# Altium project Outdoor_Tracking.PrjPcb (part 2 of 2)

## Sheet Antennas.SchDoc
size A3; ApprovedBy: Mustafa Atılay Beycan; CheckedBy: Mustafa Atılay Beycan; Author: Mustafa Atılay Beycan; CompanyName: Mustafa Atılay Beycan; DrawnBy: Mustafa Atılay Beycan; Engineer: Mustafa Atılay Beycan; Organization: Mustafa Atılay Beycan; SheetNumber: 6; SheetTotal: 8; FilePath: https://github.com/mustafaatilay/Outdoor-Tracking-Project
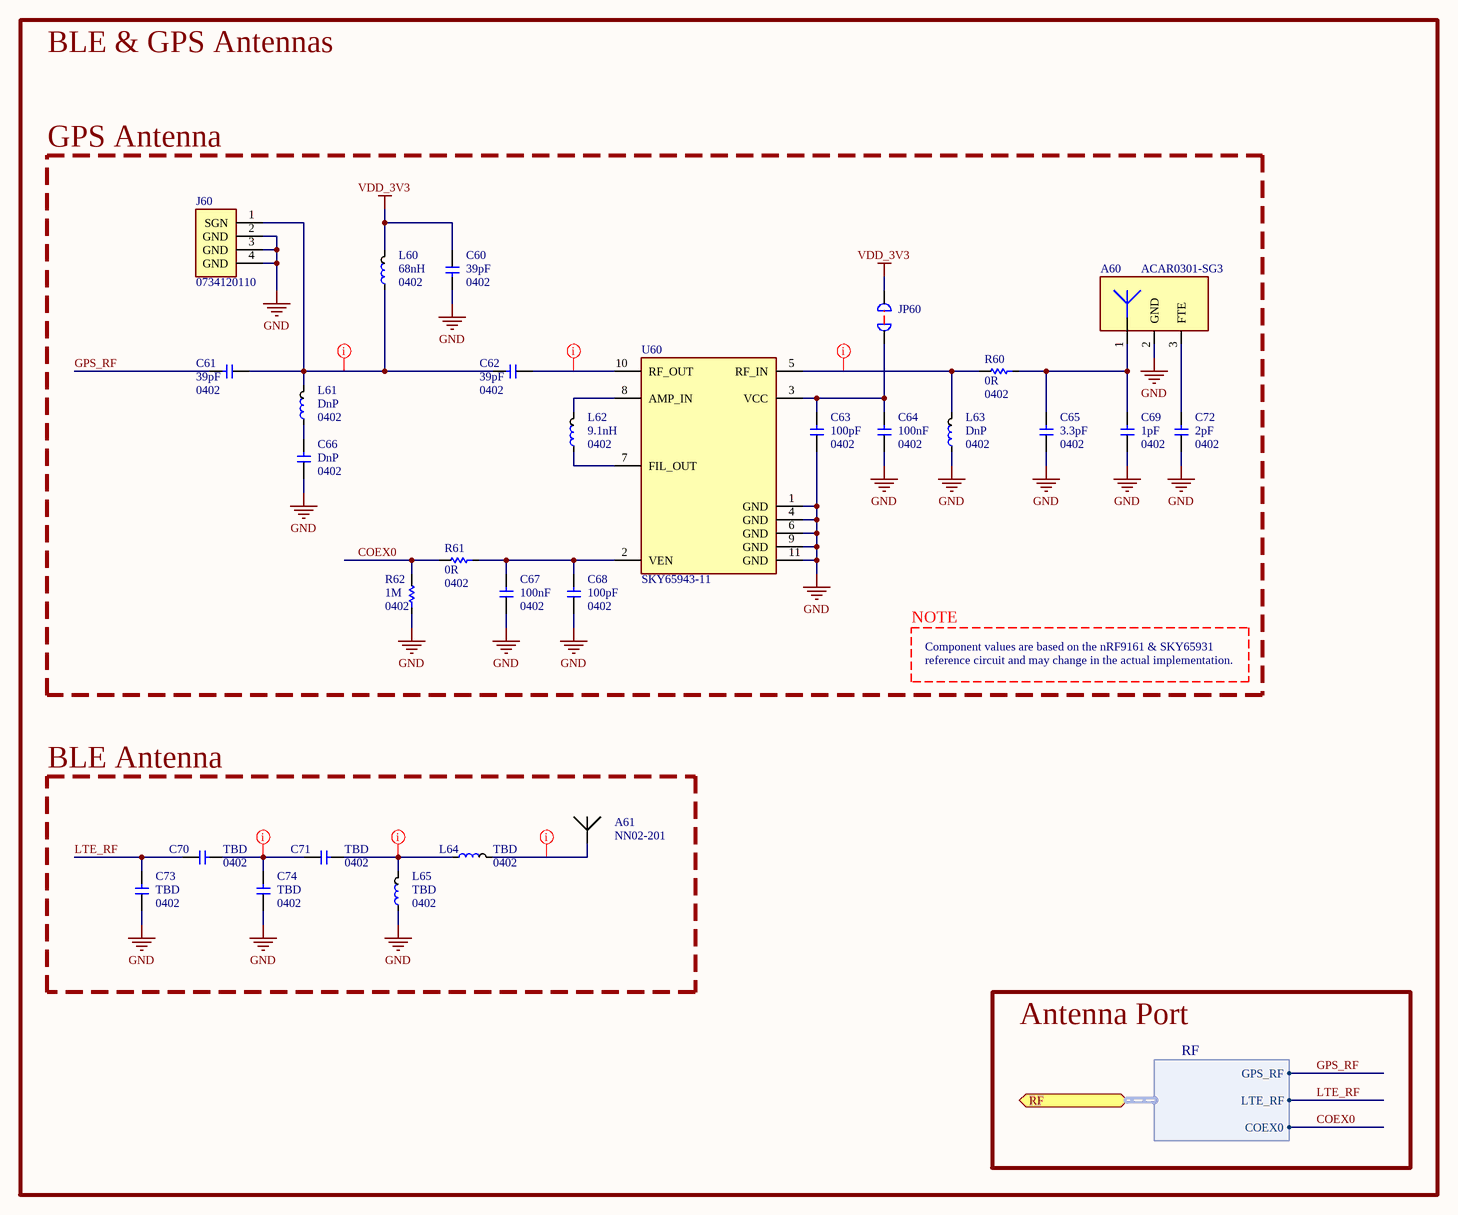
[diagram p6: Antennas.SchDoc]

### Parts
A60  ACAR0301-SG3  [ANT GPS ACAR0301-SG3]
A61  NN02-201  [ANT NN02-201]
C60  Capacitance: 39pF  Package: 0402  [CAP 0402]  (hidden comment: 39pF 1% NP0 25V 0402 SMD)
C61  Capacitance: 39pF  Package: 0402  [CAP 0402]  (hidden comment: 39pF 1% NP0 25V 0402 SMD)
C62  Capacitance: 39pF  Package: 0402  [CAP 0402]  (hidden comment: 39pF 1% NP0 25V 0402 SMD)
C63  Capacitance: 100pF  Package: 0402  [CAP 0402]  (hidden comment: 100pF 10% X7R 50V 0402 SMD)
C64  Capacitance: 100nF  Package: 0402  [CAP 0402]  (hidden comment: 100nF 10% X7R 50V 0402 SMD)
C65  Capacitance: 3.3pF  Package: 0402  [CAP 0402]  (hidden comment: 3.3pF * * * 0402 SMD)
C66  Capacitance: DnP  Package: 0402  [CAP 0402]  (hidden comment: DnP * * * 0402 SMD)
C67  Capacitance: 100nF  Package: 0402  [CAP 0402]  (hidden comment: 100nF 10% X7R 50V 0402 SMD)
C68  Capacitance: 100pF  Package: 0402  [CAP 0402]  (hidden comment: 100pF 10% X7R 50V 0402 SMD)
C69  Capacitance: 1pF  Package: 0402  [CAP 0402]  (hidden comment: 1pF * * * 0402 SMD)
C70  Capacitance: TBD  Package: 0402  [CAP 0402]  (hidden comment: TBD TBD TBD * 0402 SMD)
C71  Capacitance: TBD  Package: 0402  [CAP 0402]  (hidden comment: TBD TBD TBD * 0402 SMD)
C72  Capacitance: 2pF  Package: 0402  [CAP 0402]  (hidden comment: 2pF * * * 0402 SMD)
C73  Capacitance: TBD  Package: 0402  [CAP 0402]  (hidden comment: TBD TBD TBD * 0402 SMD)
C74  Capacitance: TBD  Package: 0402  [CAP 0402]  (hidden comment: TBD TBD TBD * 0402 SMD)
J60  0734120110  [CONN UFL 0734120110]
JP60  JUMPER CLOSED  [JP PAD 2 PIN - NET TIE]  (value not drawn)  (net tie, no BOM)
L60  Package: 0402  Inductance: 68nH  [IND 0402]  (hidden comment: IND 0402)
L61  Package: 0402  Inductance: DnP  [IND 0402]  (hidden comment: IND 0402)
L62  Package: 0402  Inductance: 9.1nH  [IND 0402]  (hidden comment: IND 0402)
L63  Package: 0402  Inductance: DnP  [IND 0402]  (hidden comment: IND 0402)
L64  Package: 0402  Inductance: TBD  [IND 0402]  (hidden comment: IND 0402)
L65  Package: 0402  Inductance: TBD  [IND 0402]  (hidden comment: IND 0402)
R60  Resistance: 0R  Package: 0402  [RES 0402]  (hidden comment: 0R 5% * 0402 SMD)
R61  Resistance: 0R  Package: 0402  [RES 0402]  (hidden comment: 0R 5% * 0402 SMD)
R62  Resistance: 1M  Package: 0402  [RES 0402]  (hidden comment: 1M 5% 1/10W 0402 SMD)
U60  SKY65943-11  [IC 10-MCM (2.5x2.5)]

### Blocks framed on the sheet
GPS Antenna: A60 C60-C69 C72 J60 JP60 L60-L63 R60-R62 U60
BLE Antenna: A61 C70 C71 C73 C74 L64 L65

### Ports
RF (bidir, harness RF)

### Harnesses
RF: GPS_RF, LTE_RF, COEX0

### Nets
GND: A60.2(GND) C60.1 C63.2 C64.2 C65.2 C66.2 C67.2 C68.2 C69.2 C72.2 C73.2 C74.2 J60.2(GND) J60.3(GND) J60.4(GND) L63.1 L65.1 R62.1 U60.1(GND) U60.4(GND) U60.6(GND) U60.9(GND) U60.11(GND)
VDD_3V3: C60.2 JP60.2 L60.2
COEX0: R61.2 R62.2 ; port RF.COEX0
GPS_RF: C61.1 ; port RF.GPS_RF
LTE_RF: C70.2 C73.1 ; port RF.LTE_RF
NetA60_1: A60.1 C65.1 C69.1 R60.1
NetA60_3: A60.3(FTE) C72.1
NetA61_1: A61.1 L64.2
NetC61_2: C61.2 C62.1 J60.1(SGN) L60.1 L61.2
NetC62_2: C62.2 U60.10(RF_OUT)
NetC63_1: C63.1 C64.1 JP60.1 U60.3(VCC)
NetC66_1: C66.1 L61.1
NetC67_1: C67.1 C68.1 R61.1 U60.2(VEN)
NetC70_1: C70.1 C71.2 C74.1
NetC71_1: C71.1 L64.1 L65.2
NetL62_1: L62.1 U60.7(FIL_OUT)
NetL62_2: L62.2 U60.8(AMP_IN)
NetL63_2: L63.2 R60.2 U60.5(RF_IN)

### Layout directives
net class GPS: NetC61_2, NetC62_2, NetL63_2
net class LTE: NetA61_1, NetC70_1, NetC71_1

### Notes on the sheet
- BLE & GPS Antennas
- NOTE
- Component values are based on the nRF9161 & SKY65931
- reference circuit and may change in the actual implementation.
- Antenna Port
- Project Name
- Designed by
- Schematic Name
- Checked by
- Page Size
- File Path
- Modified Date
- Revision No
- Sheet
- of
- A3

### Library data of the parts
A60 = ANT ACAR0301-SG3: RF ANT 1561~1610 MHZ CHIP SLD; Manufacturer: Abracon LLC; Gain: 1.69dBi, -1.81dBi, 1.43dBi; VSWR: 2; Number of Bands: 3; Frequency Range: 1.561GHz ~ 1.61GHz; Frequency (Center/Band): 1.561GHz, 1.575GHz, 1.602GHz; Frequency Group: UHF (1GHz ~ 2GHz); RF Family/Standard: Navigation; Link: https://bit.ly/3My30kV; Return Loss: -; Antenna Type: Chip; Manufacturer Product Number: ACAR0301-SG3
A61 = ANT NN02-201: ONE MXTEND MULTIBAND ANTENNA; Manufacturer: Ignion; RF Family/Standard: Cellular; Frequency Group: Ultra Wide Band; Frequency (Center/Band): 700MHz, 800MHz, 850MHz, 900MHz, 1.7GHz, 1.8GHz, 1.9GHz, 2GHz, 2.1GHz, 2.5GHz, 3.5GHz, 3.7GHz, 4.7GHz, 5GHz, 6GHz, 7GHz; Frequency Range: 824MHz ~ 7.125GHz; Antenna Type: Chip; Number of Bands: 1; VSWR: 3; Gain: 4.1dBi; Link: https://bit.ly/3T3Cfsq; Manufacturer Product Number: NN02-201; Applications: 2G, 3G, 4G, 5G, DCS, GSM, LTE, PCS, UMTS, Wifi DB
C60-C62 C65 C66 C69-C74 = CAP 0402: Link: *; Manufacturer: *; Manufacturer Part Number: *; Value: CAP 0402; Mount: SMD; ALT MALZEME KODU: *
  C60-C62: Tolerance: 1%; TemperatureCoefficient: NP0; Voltage: 25V
  C65 C66 C69 C72: Tolerance: *; TemperatureCoefficient: *; Voltage: *
  C70 C71 C73 C74: Tolerance: TBD; TemperatureCoefficient: TBD; Voltage: *
C63 C68 = CAP 0402 100pF 50V: ALT MALZEME KODU: 1.009.00236; Link: *; Manufacturer: *; Manufacturer Part Number: *; Value: 100pF 10% X7R 50V 0402 SMD; Tolerance: 10%; TemperatureCoefficient: X7R; Mount: SMD; Voltage: 50V
C64 C67 = CAP 0402 100nF 50V: ALT MALZEME KODU: 1.009.00205; Link: *; Manufacturer: *; Manufacturer Part Number: *; Value: 100nF 10% X7R 50V 0402 SMD; Tolerance: 10%; TemperatureCoefficient: X7R; Mount: SMD; Voltage: 50V
J60 = CONN 0734120110: CONN UFL RCPT STR 50 OHM SMD; Manufacturer: Molex; Frequency: 6GHz (Max); Voltage Rating: 60V; Impedance: 50Ohm; ALT MALZEME KODU: 1.010.00305; Manufacturer Part Number: 0734120110; Link: https://bit.ly/3nEZlng; Mount: SMD
JP60 = JUMPER NC
R60 R61 = RES 0402 0R 5%: ALT MALZEME KODU: 1.031.00612; Link: *; Manufacturer: *; Manufacturer Part Number: *; Value: 0R 5% * 0402 SMD; Tolerance: 5%; PowerRating: *; Mount: SMD
R62 = RES 0402 1M 5%: ALT MALZEME KODU: 1.031.00624; Link: *; Manufacturer: *; Manufacturer Part Number: *; Value: 1M 5% 1/10W 0402 SMD; PowerRating: 1/10W; Mount: SMD; Tolerance: 5%
U60 = IC SKY65943-11: GPS LNA MODULE; Manufacturer: Skyworks Solutions Inc.; RF Type: Galileo, GLONASS, GNSS, GPS; Frequency: 1.559GHz ~ 1.606GHz; Link: https://bit.ly/3R1qSA0
L60-L65 = IND 0402: Link: *; Manufacturer: *; Manufacturer Part Number: *; Value: IND 0402; Mount: SMD; ALT MALZEME KODU: *

## Sheet SIM_Connector.SchDoc
size A3; ApprovedBy: Mustafa Atılay Beycan; CheckedBy: Mustafa Atılay Beycan; Author: Mustafa Atılay Beycan; CompanyName: Mustafa Atılay Beycan; DrawnBy: Mustafa Atılay Beycan; Engineer: Mustafa Atılay Beycan; Organization: Mustafa Atılay Beycan; SheetNumber: 7; SheetTotal: 8; FilePath: https://github.com/mustafaatilay/Outdoor-Tracking-Project
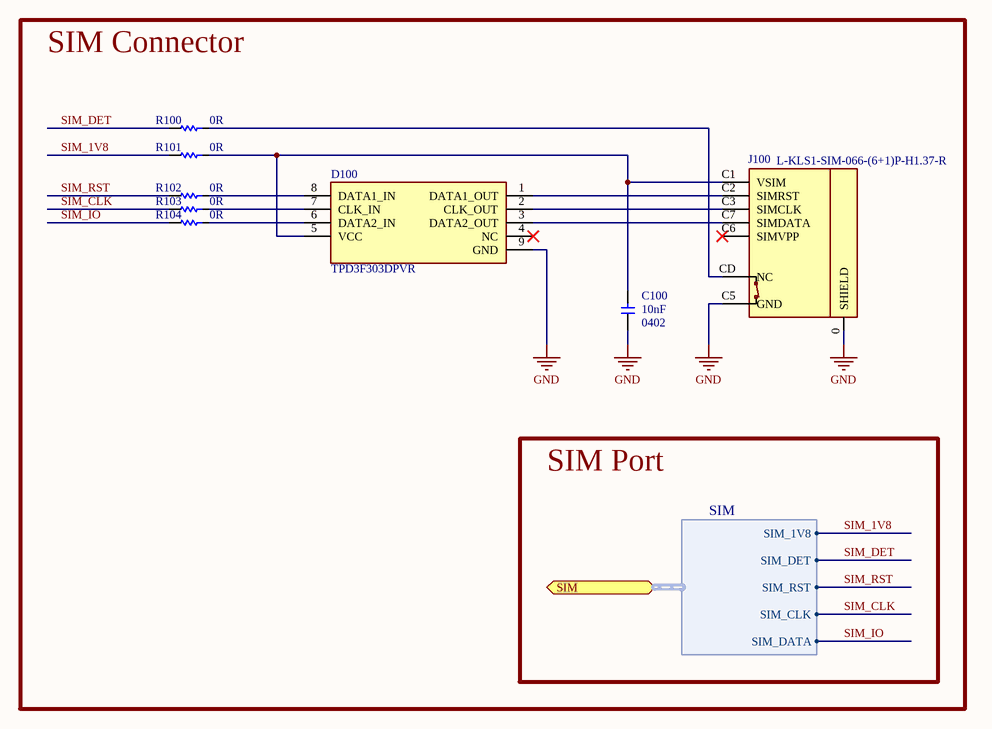
[diagram p7: SIM_Connector.SchDoc]

### Parts
C100  Capacitance: 10nF  Package: 0402  [CAP 0402]  (hidden comment: 10nF 10% X7R 16V 0402 SMD)
D100  TPD3F303DPVR  [IC 8-UFDFN Exposed Pad]
J100  L-KLS1-SIM-066-(6+1)P-H1.37-R  [CONN L-KLS1-SIM-066-(6+1)P-H1]
R100  Resistance: 0R  [RES 0402]  (hidden comment: 0R 5% * 0402 SMD)
R101  Resistance: 0R  [RES 0402]  (hidden comment: 0R 5% * 0402 SMD)
R102  Resistance: 0R  [RES 0402]  (hidden comment: 0R 5% * 0402 SMD)
R103  Resistance: 0R  [RES 0402]  (hidden comment: 0R 5% * 0402 SMD)
R104  Resistance: 0R  [RES 0402]  (hidden comment: 0R 5% * 0402 SMD)

### Ports
SIM (bidir, harness SIM)

### Harnesses
SIM: SIM_1V8, SIM_DET, SIM_RST, SIM_CLK, SIM_DATA

### Nets
GND: C100.2 D100.9(GND) J100.0(SHIELD) J100.C5(GND)
SIM_1V8: R101.2 ; port SIM.SIM_1V8
SIM_CLK: R103.2 ; port SIM.SIM_CLK
SIM_DET: R100.2 ; port SIM.SIM_DET
SIM_IO: R104.2 ; port SIM.SIM_DATA
SIM_RST: R102.2 ; port SIM.SIM_RST
NetC100_1: C100.1 D100.5(VCC) J100.C1(VSIM) R101.1
NetD100_1: D100.1(DATA1_OUT) J100.C2(SIMRST)
NetD100_2: D100.2(CLK_OUT) J100.C3(SIMCLK)
NetD100_3: D100.3(DATA2_OUT) J100.C7(SIMDATA)
NetD100_6: D100.6(DATA2_IN) R104.1
NetD100_7: D100.7(CLK_IN) R103.1
NetD100_8: D100.8(DATA1_IN) R102.1
NetJ100_CD: J100.CD(NC) R100.1

Not connected (* = marked no-connect by the designer): D100 4(NC)*; J100 C6(SIMVPP)*

### Notes on the sheet
- SIM Connector
- SIM Port
- Project Name
- Designed by
- Schematic Name
- Checked by
- Page Size
- File Path
- Modified Date
- Revision No
- Sheet
- of
- A3

### Library data of the parts
C100 = CAP 0402 10nF 16V: ALT MALZEME KODU: 1.009.00283; Link: *; Manufacturer: *; Manufacturer Part Number: *; Value: 10nF 10% X7R 16V 0402 SMD; Tolerance: 10%; TemperatureCoefficient: X7R; Mount: SMD; Voltage: 16V
D100 = IC TPD3F303DPVR: FILTER RC(PI) ESD SMD; Manufacturer: Texas Instruments; Type: Low Pass; Filter Order: 2nd; Number of Channels: 3; Center / Cutoff Frequency: 294MHz, 308MHz (Cutoff); Resistance - Channel (Ohms): 47, 100; Values: R = 47Ohms, 100Ohms, C = 20pF; ESD Protection: Yes; Link: https://bit.ly/475RMgT; Manufacturer Product Number: TPD3F303DPVR; Technology: RC (Pi); Applications: Data Lines for Mobile Devices
J100 = CONN L-KLS1-SIM-066-(6+1)P-H1.37-R: CONNECTOR HOLDER SIM CARD (6+1) PUSH-PUSH TYPE; Manufacturer: KLS ELECTRONIC; Ejector Side: Right; Card Type: Sim Card Connectors; Link: https://bit.ly/3WZrGro; Series: KLS1-SIM-066; Number of Pins: 7(6+1); Insertion, Removal Method: Push-Push
R100-R104 = RES 0402 0R 5%: ALT MALZEME KODU: 1.031.00612; Link: *; Manufacturer: *; Manufacturer Part Number: *; Value: 0R 5% * 0402 SMD; Tolerance: 5%; PowerRating: *; Mount: SMD; Package: 0402

## Nets that join several sheets
GND: nRF9161 (55 pins), Power_Management (24 pins), USB_to_UART (18 pins), Peripheral (25 pins), Antennas (23 pins), SIM_Connector (C100.2 D100.9 J100.0 J100.C5)
VBUS: Power_Management (C20.1 U20.21), USB_to_UART (7 pins)
VDD_3V3: nRF9161 (15 pins), Power_Management (LD20.2 LD20.4 LD20.6 R21.1), Peripheral (8 pins), Antennas (C60.2 JP60.2 L60.2)
ACC_INT: nRF9161 (U1.15), Peripheral (R82.1 R83.1)
BAR_INT: nRF9161 (U1.16), Peripheral (R94.1)
BUTTON_1: nRF9161 (U1.3), Peripheral (C86.1 R85.1 R89.1)
BUTTON_2: nRF9161 (U1.2), Peripheral (C85.1 R84.1 R88.1)
CC1: Power_Management (U20.23), USB_to_UART (C45.1 J1.A5 R45.2)
CC2: Power_Management (U20.24), USB_to_UART (C46.1 J1.B5 R46.2)
COEX0: nRF9161 (U1.93), Antennas (R61.2 R62.2)
GPS_RF: nRF9161 (U1.67), Antennas (C61.1)
I2C_SCL: nRF9161 (R3.1 U1.89), Power_Management (U20.14), Peripheral (U80.1 U81.2)
I2C_SDA: nRF9161 (R4.1 U1.88), Power_Management (U20.13), Peripheral (U80.4 U81.4)
LED_BLUE: nRF9161 (U1.97), Peripheral (R96.2 R97.2)
LED_GREEN: nRF9161 (U1.95), Peripheral (R90.2 R92.2)
LED_RED: nRF9161 (U1.96), Peripheral (R91.2 R93.2)
LTE_RF: nRF9161 (U1.61), Antennas (C70.2 C73.1)
PMIC_GPIO0: nRF9161 (U1.4), Power_Management (U20.7)
PMIC_GPIO1: nRF9161 (U1.18), Power_Management (U20.8)
PMIC_GPIO2: nRF9161 (U1.19), Power_Management (U20.9)
PMIC_GPIO3: nRF9161 (U1.20), Power_Management (U20.10)
PMIC_GPIO4: nRF9161 (U1.99), Power_Management (U20.11)
RXD0: nRF9161 (U1.83), USB_to_UART (U40.26)
SHPHLD: nRF9161 (U1.86), Power_Management (U20.15)
SIM_1V8: nRF9161 (U1.49), SIM_Connector (R101.2)
SIM_CLK: nRF9161 (U1.46), SIM_Connector (R103.2)
SIM_DET: nRF9161 (U1.45), SIM_Connector (R100.2)
SIM_IO: nRF9161 (U1.48), SIM_Connector (R104.2)
SIM_RST: nRF9161 (U1.43), SIM_Connector (R102.2)
TXD0: nRF9161 (U1.84), USB_to_UART (U40.25)

## Assembly variants
Outdoor_Tracking: not fitted R3 R4 R82 U22